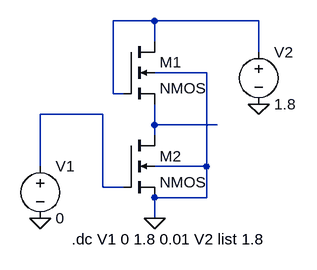
[diagram p0: schematic depletion.asc]
depletion.asc, the LTspice schematic file:
Version 4
SHEET 1 880 680
WIRE 112 32 48 32
WIRE 272 32 112 32
WIRE 112 64 112 32
WIRE 272 80 272 32
WIRE 192 112 112 112
WIRE 48 144 48 32
WIRE 64 144 48 144
WIRE 32 176 -64 176
WIRE 112 192 112 160
WIRE 208 192 112 192
WIRE 112 208 112 192
WIRE -64 256 -64 176
WIRE 192 256 192 112
WIRE 192 256 112 256
WIRE 32 288 32 176
WIRE 64 288 32 288
WIRE 192 304 192 256
WIRE 192 304 112 304
WIRE 112 336 112 304
FLAG 272 160 0
FLAG 112 336 0
FLAG -64 336 0
SYMBOL nmos4 64 64 R0
SYMATTR InstName M1
SYMATTR Value2 l=270n w=400n
SYMBOL nmos4 64 208 R0
SYMATTR InstName M2
SYMATTR Value2 l=270n w=4000n
SYMBOL voltage -64 240 R0
WINDOW 123 0 0 Left 0
WINDOW 39 0 0 Left 0
SYMATTR InstName V1
SYMATTR Value 0
SYMBOL voltage 272 64 R0
WINDOW 123 0 0 Left 0
WINDOW 39 0 0 Left 0
SYMATTR InstName V2
SYMATTR Value 1.8
TEXT -16 368 Left 2 !.dc V1 0 1.8 0.01 V2 list 1.8

The netlist it stands for:
* depletion.asc
M1 N001 N001 N003 0 NMOS l=270n w=400n
M2 N003 N002 0 0 NMOS l=270n w=4000n
V1 N002 0 0
V2 N001 0 1.8
.model NMOS NMOS
.model PMOS PMOS
.lib standard.mos
.dc V1 0 1.8 0.01 V2 list 1.8
.backanno
.end